# Altium project DamperSectionProject.PrjPCB
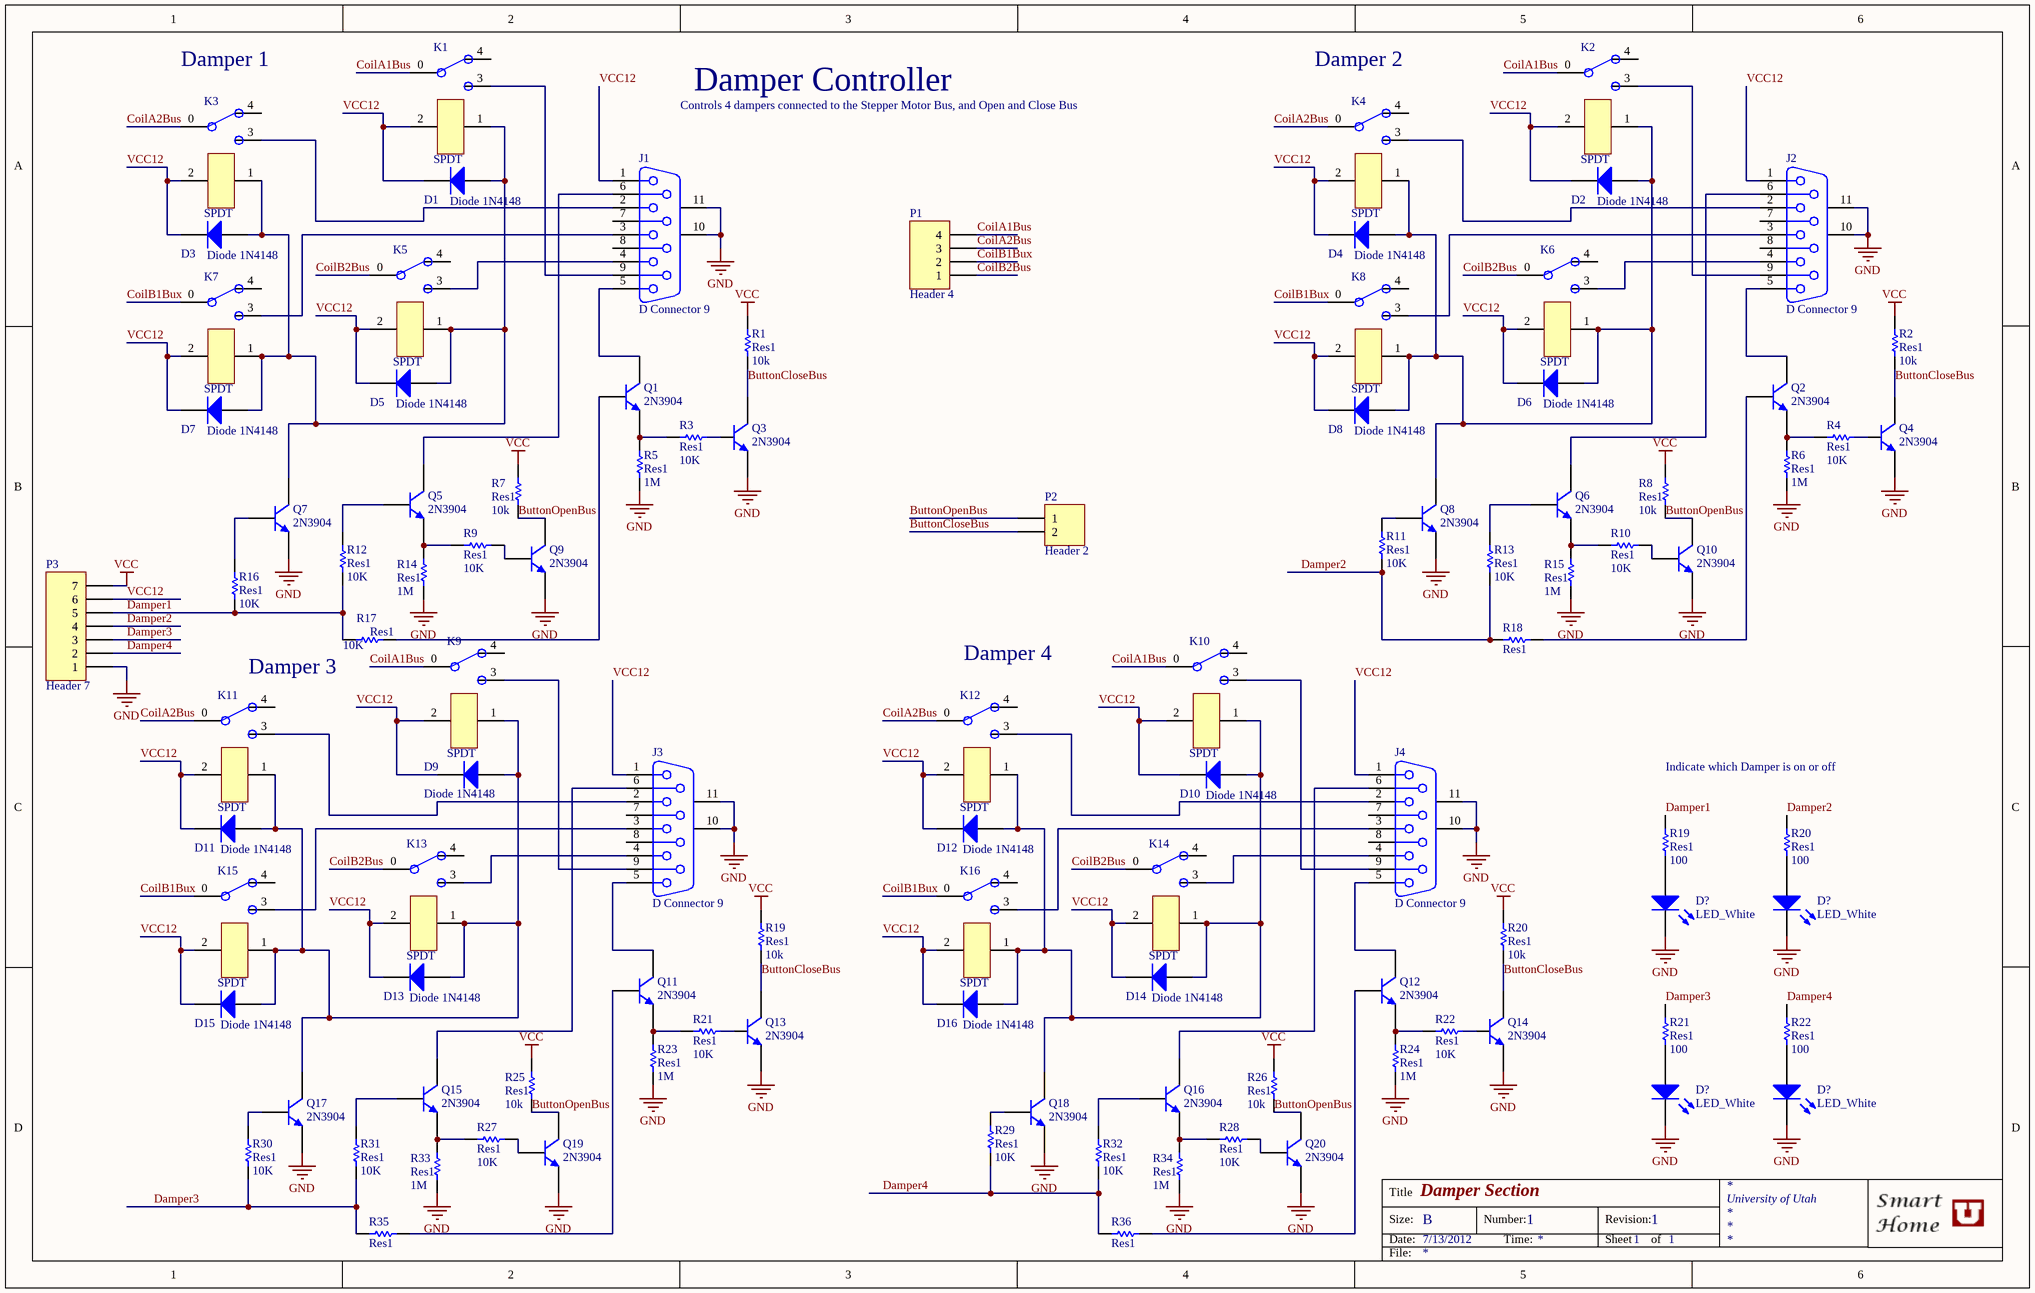
[diagram p0: DamperSection.SchDoc]
1 sheet, 103 parts. Net scope: global (net labels, ports and power ports of the same name join across sheets).
Board file: DamperSectionPCB.PcbDoc

## Sheet DamperSection.SchDoc: Damper Section
size B; Date: 7/13/2012; ApprovedBy: Levi Balling; CheckedBy: Dell Hanks; Author: Levi Balling; CompanyName: Smart Home; DrawnBy: Levi Balling; Engineer: Levi Balling; Address1: University of Utah; DocumentNumber: 1; Revision: 1; SheetNumber: 1; SheetTotal: 1; CurrentDate: 7/13/2012; DocumentName: Damper Section; ProjectName: Smart Home

### Parts
(Parts that share a designator on the sheet are numbered #1, #2 ... from top to bottom, then left to right.)
D1  Diode 1N4148  [DO-35]
D2  Diode 1N4148  [DO-35]
D3  Diode 1N4148  [DO-35]
D4  Diode 1N4148  [DO-35]
D5  Diode 1N4148  [DO-35]
D6  Diode 1N4148  [DO-35]
D7  Diode 1N4148  [DO-35]
D8  Diode 1N4148  [DO-35]
D9  Diode 1N4148  [DO-35]
D10  Diode 1N4148  [DO-35]
D11  Diode 1N4148  [DO-35]
D12  Diode 1N4148  [DO-35]
D13  Diode 1N4148  [DO-35]
D14  Diode 1N4148  [DO-35]
D15  Diode 1N4148  [DO-35]
D16  Diode 1N4148  [DO-35]
D?#1  LED_White  [LED-0]
D?#2  LED_White  [LED-0]
D?#3  LED_White  [LED-0]
D?#4  LED_White  [LED-0]
J1  D Connector 9  [DSUB1.385-2H9]
J2  D Connector 9  [DSUB1.385-2H9]
J3  D Connector 9  [DSUB1.385-2H9]
J4  D Connector 9  [DSUB1.385-2H9]
K1  SPDT  [Relay  SPDT Tayda]
K2  SPDT  [Relay  SPDT Tayda]
K3  SPDT  [Relay  SPDT Tayda]
K4  SPDT  [Relay  SPDT Tayda]
K5  SPDT  [Relay  SPDT Tayda]
K6  SPDT  [Relay  SPDT Tayda]
K7  SPDT  [Relay  SPDT Tayda]
K8  SPDT  [Relay  SPDT Tayda]
K9  SPDT  [Relay  SPDT Tayda]
K10  SPDT  [Relay  SPDT Tayda]
K11  SPDT  [Relay  SPDT Tayda]
K12  SPDT  [Relay  SPDT Tayda]
K13  SPDT  [Relay  SPDT Tayda]
K14  SPDT  [Relay  SPDT Tayda]
K15  SPDT  [Relay  SPDT Tayda]
K16  SPDT  [Relay  SPDT Tayda]
P1  Header 4  [HDR1X4]
P2  Header 2  [HDR1X2]
P3  Header 7  [HDR1X7]
Q1  2N3904  [2N3904]
Q2  2N3904  [2N3904]
Q3  2N3904  [2N3904]
Q4  2N3904  [2N3904]
Q5  2N3904  [2N3904]
Q6  2N3904  [2N3904]
Q7  2N3904  [2N3904]
Q8  2N3904  [2N3904]
Q9  2N3904  [2N3904]
Q10  2N3904  [2N3904]
Q11  2N3904  [2N3904]
Q12  2N3904  [2N3904]
Q13  2N3904  [2N3904]
Q14  2N3904  [2N3904]
Q15  2N3904  [2N3904]
Q16  2N3904  [2N3904]
Q17  2N3904  [2N3904]
Q18  2N3904  [2N3904]
Q19  2N3904  [2N3904]
Q20  2N3904  [2N3904]
R1  Res1  value 10k  [AXIAL-0.3]
R2  Res1  value 10k  [AXIAL-0.3]
R3  Res1  value 10K  [AXIAL-0.3]
R4  Res1  value 10K  [AXIAL-0.3]
R5  Res1  value 1M  [AXIAL-0.3]
R6  Res1  value 1M  [AXIAL-0.3]
R7  Res1  value 10k  [AXIAL-0.3]
R8  Res1  value 10k  [AXIAL-0.3]
R9  Res1  value 10K  [AXIAL-0.3]
R10  Res1  value 10K  [AXIAL-0.3]
R11  Res1  value 10K  [AXIAL-0.3]
R12  Res1  value 10K  [AXIAL-0.3]
R13  Res1  value 10K  [AXIAL-0.3]
R14  Res1  value 1M  [AXIAL-0.3]
R15  Res1  value 1M  [AXIAL-0.3]
R16  Res1  value 10K  [AXIAL-0.3]
R17  Res1  value 10K  [AXIAL-0.3]
R18  Res1  [AXIAL-0.3]
R19#1  Res1  value 100  [AXIAL-0.3]
R19#2  Res1  value 10k  [AXIAL-0.3]
R20#1  Res1  value 100  [AXIAL-0.3]
R20#2  Res1  value 10k  [AXIAL-0.3]
R21#1  Res1  value 10K  [AXIAL-0.3]
R21#2  Res1  value 100  [AXIAL-0.3]
R22#1  Res1  value 10K  [AXIAL-0.3]
R22#2  Res1  value 100  [AXIAL-0.3]
R23  Res1  value 1M  [AXIAL-0.3]
R24  Res1  value 1M  [AXIAL-0.3]
R25  Res1  value 10k  [AXIAL-0.3]
R26  Res1  value 10k  [AXIAL-0.3]
R27  Res1  value 10K  [AXIAL-0.3]
R28  Res1  value 10K  [AXIAL-0.3]
R29  Res1  value 10K  [AXIAL-0.3]
R30  Res1  value 10K  [AXIAL-0.3]
R31  Res1  value 10K  [AXIAL-0.3]
R32  Res1  value 10K  [AXIAL-0.3]
R33  Res1  value 1M  [AXIAL-0.3]
R34  Res1  value 1M  [AXIAL-0.3]
R35  Res1  [AXIAL-0.3]
R36  Res1  [AXIAL-0.3]

### Nets
GND: D?#1.2(K) D?#2.2(K) D?#3.2(K) D?#4.2(K) J1.10(MH1) J1.11(MH2) J2.10(MH1) J2.11(MH2) J3.10(MH1) J3.11(MH2) J4.10(MH1) J4.11(MH2) P3.1 Q3.1(E) Q4.1(E) Q7.1(E) Q8.1(E) Q9.1(E) Q10.1(E) Q13.1(E) Q14.1(E) Q17.1(E) Q18.1(E) Q19.1(E) Q20.1(E) R5.1 R6.1 R14.1 R15.1 R23.1 R24.1 R33.1 R34.1
VCC: P3.7 R1.2 R2.2 R7.2 R8.2 R19#2.2 R20#2.2 R25.2 R26.2
ButtonCloseBus: P2.2 Q3.3(C) Q4.3(C) Q13.3(C) Q14.3(C) R1.1 R2.1 R19#2.1 R20#2.1
ButtonOpenBus: P2.1 Q9.3(C) Q10.3(C) Q19.3(C) Q20.3(C) R7.1 R8.1 R25.1 R26.1
CoilA1Bus: K1.0 K2.0 K9.0 K10.0 P1.4
CoilA2Bus: K3.0 K4.0 K11.0 K12.0 P1.3
CoilB1Bux: K7.0 K8.0 K15.0 K16.0 P1.2
CoilB2Bus: K5.0 K6.0 K13.0 K14.0 P1.1
Damper1: P3.5 R12.1 R16.1 R17.1 R19#1.1
Damper2: P3.4 R11.1 R13.1 R18.1 R20#1.1
Damper3: P3.3 R21#2.1 R30.1 R31.1 R35.1
Damper4: P3.2 R22#2.1 R29.1 R32.1 R36.1
VCC12: D1.2(K) D2.2(K) D3.2(K) D4.2(K) D5.2(K) D6.2(K) D7.2(K) D8.2(K) D9.2(K) D10.2(K) D11.2(K) D12.2(K) D13.2(K) D14.2(K) D15.2(K) D16.2(K) J1.1 J2.1 J3.1 J4.1 K1.2 K2.2 K3.2 K4.2 K5.2 K6.2 K7.2 K8.2 K9.2 K10.2 K11.2 K12.2 K13.2 K14.2 K15.2 K16.2 P3.6
NetD1_1: D1.1(A) D3.1(A) D5.1(A) D7.1(A) K1.1 K3.1 K5.1 K7.1 Q7.3(C)
NetD2_1: D2.1(A) D4.1(A) D6.1(A) D8.1(A) K2.1 K4.1 K6.1 K8.1 Q8.3(C)
NetD9_1: D9.1(A) D11.1(A) D13.1(A) D15.1(A) K9.1 K11.1 K13.1 K15.1 Q17.3(C)
NetD10_1: D10.1(A) D12.1(A) D14.1(A) D16.1(A) K10.1 K12.1 K14.1 K16.1 Q18.3(C)
NetD?#1_1: D?#1.1(A) R19#1.2
NetD?#2_1: D?#2.1(A) R20#1.2
NetD?#3_1: D?#3.1(A) R21#2.2
NetD?#4_1: D?#4.1(A) R22#2.2
NetJ1_2: J1.2 K3.3
NetJ1_3: J1.3 K7.3
NetJ1_4: J1.4 K5.3
NetJ1_5: J1.5 Q1.3(C)
NetJ1_6: J1.6 Q5.3(C)
NetJ1_9: J1.9 K1.3
NetJ2_2: J2.2 K4.3
NetJ2_3: J2.3 K8.3
NetJ2_4: J2.4 K6.3
NetJ2_5: J2.5 Q2.3(C)
NetJ2_6: J2.6 Q6.3(C)
NetJ2_9: J2.9 K2.3
NetJ3_2: J3.2 K11.3
NetJ3_3: J3.3 K15.3
NetJ3_4: J3.4 K13.3
NetJ3_5: J3.5 Q11.3(C)
NetJ3_6: J3.6 Q15.3(C)
NetJ3_9: J3.9 K9.3
NetJ4_2: J4.2 K12.3
NetJ4_3: J4.3 K16.3
NetJ4_4: J4.4 K14.3
NetJ4_5: J4.5 Q12.3(C)
NetJ4_6: J4.6 Q16.3(C)
NetJ4_9: J4.9 K10.3
NetQ1_1: Q1.1(E) R3.1 R5.2
NetQ1_2: Q1.2(B) R17.2
NetQ2_1: Q2.1(E) R4.1 R6.2
NetQ2_2: Q2.2(B) R18.2
NetQ3_2: Q3.2(B) R3.2
NetQ4_2: Q4.2(B) R4.2
NetQ5_1: Q5.1(E) R9.1 R14.2
NetQ5_2: Q5.2(B) R12.2
NetQ6_1: Q6.1(E) R10.1 R15.2
NetQ6_2: Q6.2(B) R13.2
NetQ7_2: Q7.2(B) R16.2
NetQ8_2: Q8.2(B) R11.2
NetQ9_2: Q9.2(B) R9.2
NetQ10_2: Q10.2(B) R10.2
NetQ11_1: Q11.1(E) R21#1.1 R23.2
NetQ11_2: Q11.2(B) R35.2
NetQ12_1: Q12.1(E) R22#1.1 R24.2
NetQ12_2: Q12.2(B) R36.2
NetQ13_2: Q13.2(B) R21#1.2
NetQ14_2: Q14.2(B) R22#1.2
NetQ15_1: Q15.1(E) R27.1 R33.2
NetQ15_2: Q15.2(B) R31.2
NetQ16_1: Q16.1(E) R28.1 R34.2
NetQ16_2: Q16.2(B) R32.2
NetQ17_2: Q17.2(B) R30.2
NetQ18_2: Q18.2(B) R29.2
NetQ19_2: Q19.2(B) R27.2
NetQ20_2: Q20.2(B) R28.2

Not connected (* = marked no-connect by the designer): J1 7 8; J2 7 8; J3 7 8; J4 7 8; K1 4; K2 4; K3 4; K4 4; K5 4; K6 4; K7 4; K8 4; K9 4; K10 4; K11 4; K12 4; K13 4; K14 4; K15 4; K16 4

### Notes on the sheet
- (near K3) Damper 1
- Damper Controller
- (near K4) Damper 2
- Controls 4 dampers connected to the Stepper Motor Bus, and Open and Close Bus
- Damper 3
- (near K12) Damper 4
- Indicate which Damper is on or off
- Title
- Size:
- Date:
- B
- Number:
- Time:
- Revision:
- Sheet
- of
- File:

### Library data of the parts
D1-D16 = Diode 1N4148: High Conductance Fast Diode; Published: 8-Jun-2000; LatestRevisionDate: 17-Jul-2002; LatestRevisionNote: Re-released for DXP Platform.; DatasheetVersion: 1997; PackageReference: DO-35; Publisher: Altium Limited; PackageDescription: Diode, Axial; Body 3.8 x 1.9 mm (LxDia. max), Lead Dia. 0.53 mm (max); Code_JEDEC: DO-204-AH; ComponentLink1Description: Manufacturer Link; ComponentLink1URL: http://www.fairchildsemi.com/; ComponentLink2Description: Datasheet; ComponentLink2URL: http://www.fairchildsemi.com/ds/1N%2F1N4148.pdf
D?#1-D?#4 = LED0: Typical INFRARED GaAs LED; Published: 8-Jun-2000; LatestRevisionDate: 08-Jul-2005; LatestRevisionNote: Mech Layer 1 removed.; PackageReference: LED-0; Publisher: Altium Limited; PackageDescription: LED; 2 Leads
J1-J4 = D Connector 9: Receptacle Assembly, 9 Position, Right Angle; PackageDocument: O; Positions: 9; Published: 15-Jun-2001; LatestRevisionDate: 17-Jul-2002; LatestRevisionNote: Re-released for DXP Platform.; DatasheetDocument: 1-Sep-1999; PackageReference: 788750; Publisher: Altium Limited; Orientation: Right Angle; Gender: Receptacle
P1 = Header 4: Header, 4-Pin; LatestRevisionDate: 17-Jul-2002; LatestRevisionNote: Re-released for DXP Platform.; Publisher: Altium Limited
P2 = Header 2: Header, 2-Pin; LatestRevisionDate: 17-Jul-2002; LatestRevisionNote: Re-released for DXP Platform.; Publisher: Altium Limited
P3 = Header 7: Header, 7-Pin; LatestRevisionDate: 17-Jul-2002; LatestRevisionNote: Re-released for DXP Platform.; Publisher: Altium Limited
Q1-Q20 = 2N3904: NPN General Purpose Amplifier; Published: 8-Jun-2000; LatestRevisionDate: 15-Jan-2003; LatestRevisionNote: PCB Footprint 'BCY-W3/D4.7' replaced; DatasheetVersion: 1997; PackageVersion: Sep-1998; PackageReference: TO-92A; Publisher: Altium Limited; PackageDescription: TO, Flat Index; 3 In-Line, Axial Leads; Body Dia. 4.5mm; Leads 0.51 x 0.48 mm (max); ComponentLink1Description: Manufacturer Link; ComponentLink1URL: http://www.fairchildsemi.com/; ComponentLink2Description: Datasheet; ComponentLink2URL: http://www.fairchildsemi.com/ds/2N%2F2N3904.pdf
R1-R18 R19#1 R19#2 R20#1 R20#2 R21#1 R21#2 R22#1 R22#2 R23-R36 = Res1: Resistor; Published: 8-Jun-2000; LatestRevisionDate: 17-Jul-2002; LatestRevisionNote: Re-released for DXP Platform.; PackageReference: AXIAL-0.3; Publisher: Altium Limited; PackageDescription: Axial Device, Thru-Hole; 2 Leads; 0.3 in Pin Spacing